# Altium schematic sheet Digital.SchDoc
size A2
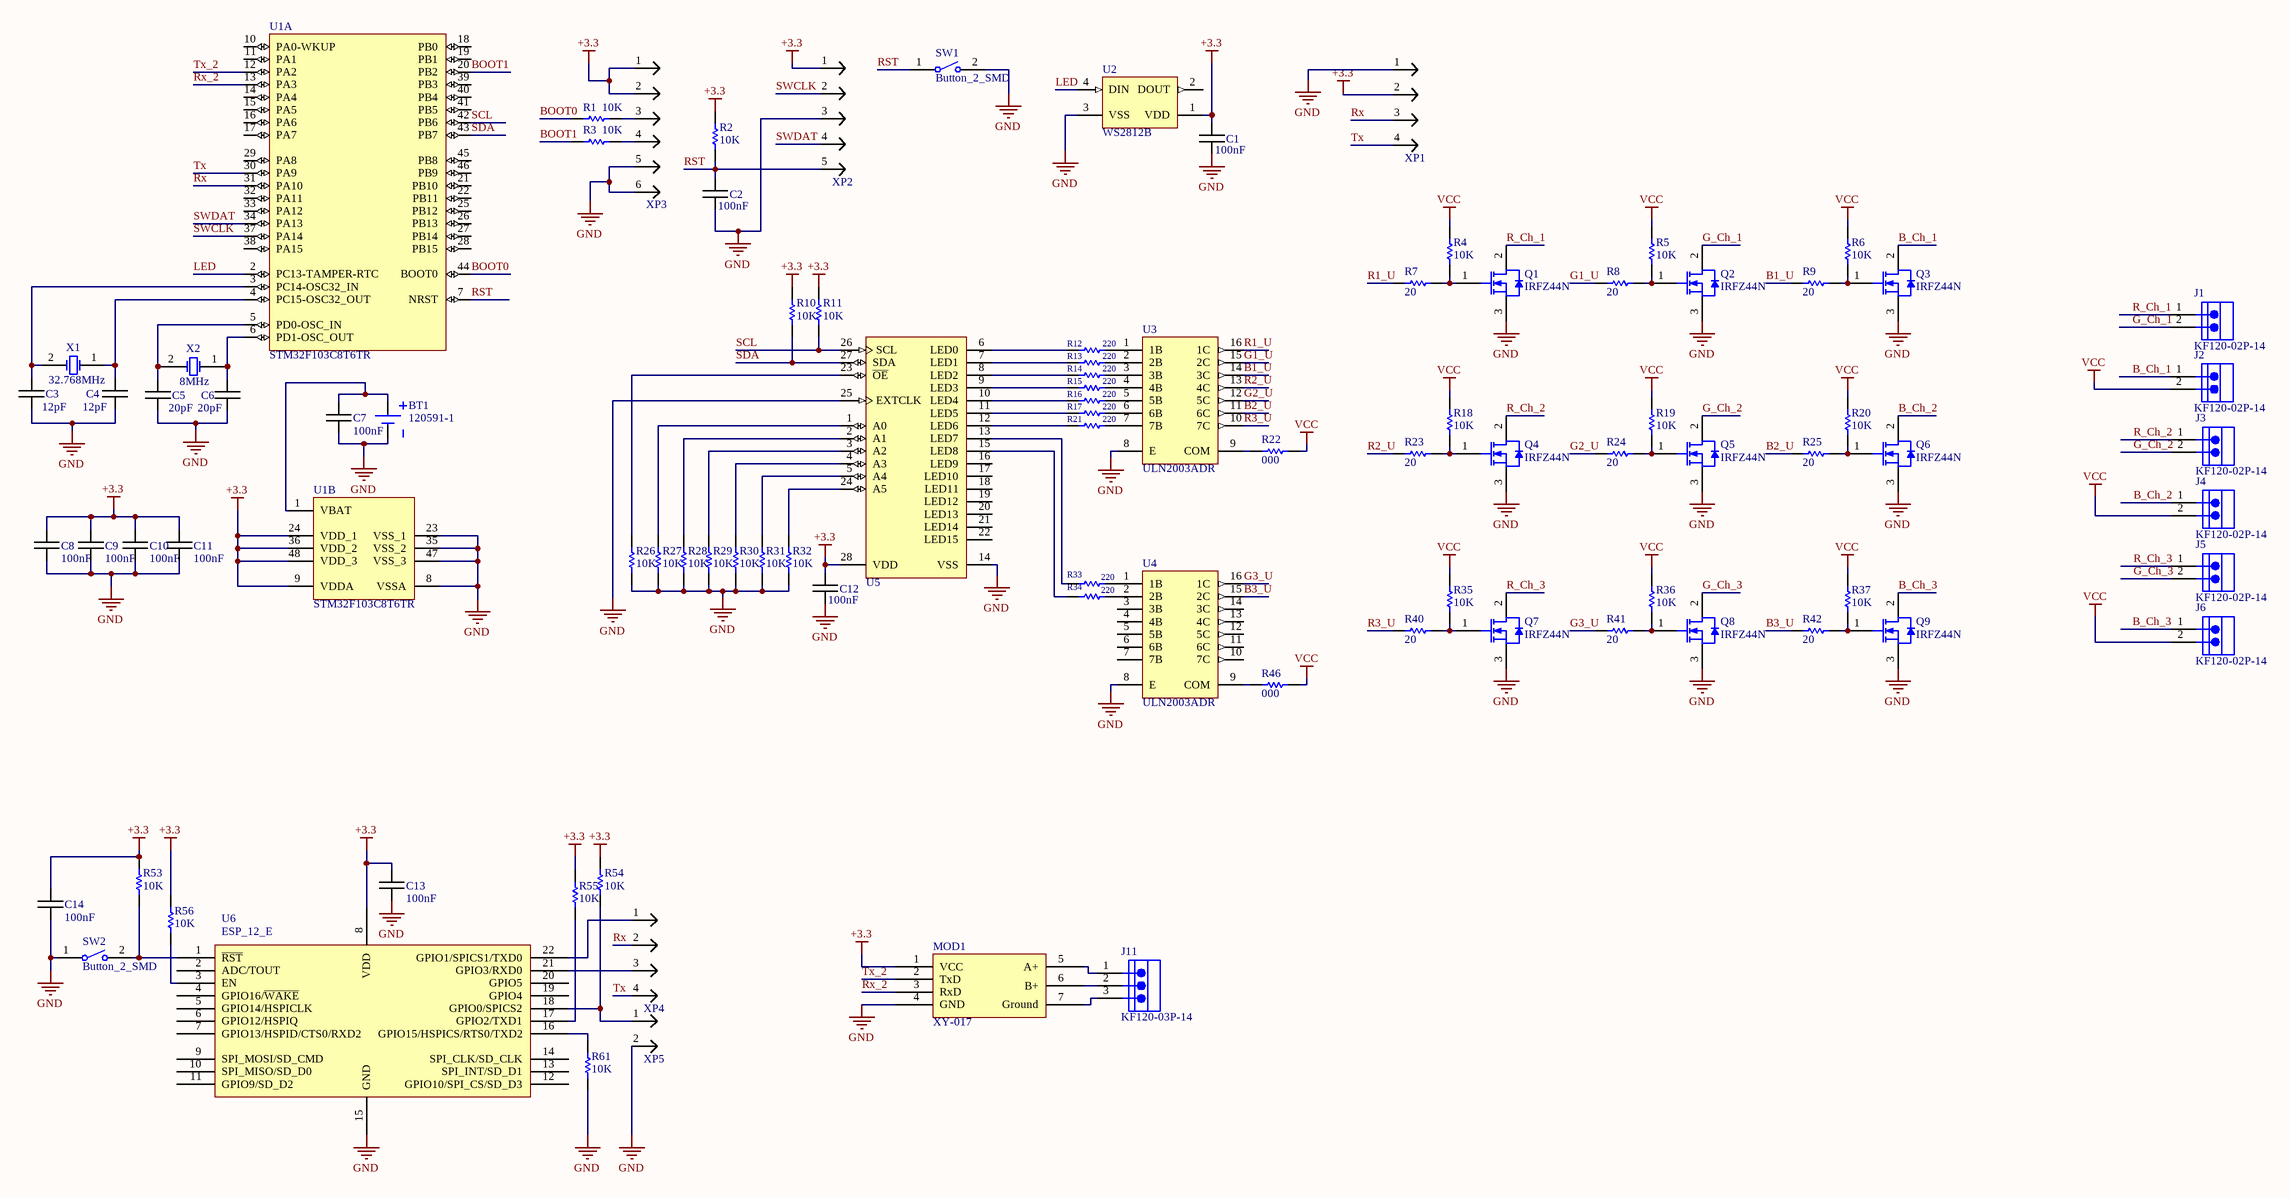
[diagram p0: Digital.SchDoc]

## Parts
BT1  120591-1  [TECO-120591-1-2_V]
C1  Val: 100nF  [CAP0805]  (hidden comment: CAP_SMD)
C2  Val: 100nF  [CAP0805]  (hidden comment: CAP_SMD)
C3  Val: 12pF  [CAP0805]  (hidden comment: CAP_SMD)
C4  Val: 12pF  [CAP0805]  (hidden comment: CAP_SMD)
C5  Val: 20pF  [CAP0805]  (hidden comment: CAP_SMD)
C6  Val: 20pF  [CAP0805]  (hidden comment: CAP_SMD)
C7  Val: 100nF  [CAP0805]  (hidden comment: CAP_SMD)
C8  Val: 100nF  [CAP0805]  (hidden comment: CAP_SMD)
C9  Val: 100nF  [CAP0805]  (hidden comment: CAP_SMD)
C10  Val: 100nF  [CAP0805]  (hidden comment: CAP_SMD)
C11  Val: 100nF  [CAP0805]  (hidden comment: CAP_SMD)
C12  Val: 100nF  [CAP0805]  (hidden comment: CAP_SMD)
C13  Val: 100nF  [CAP0805]  (hidden comment: CAP_SMD)
C14  Val: 100nF  [CAP0805]  (hidden comment: CAP_SMD)
J1  KF120-02P-14  [KF350-3.5-02P]
J2  KF120-02P-14  [KF350-3.5-02P]
J3  KF120-02P-14  [KF350-3.5-02P]
J4  KF120-02P-14  [KF350-3.5-02P]
J5  KF120-02P-14  [KF350-3.5-02P]
J6  KF120-02P-14  [KF350-3.5-02P]
J11  KF120-03P-14  [KF350-3.5-03P]
MOD1  XY-017  [XY-017]
Q1  IRFZ44N  [TO-220]
Q2  IRFZ44N  [TO-220]
Q3  IRFZ44N  [TO-220]
Q4  IRFZ44N  [TO-220]
Q5  IRFZ44N  [TO-220]
Q6  IRFZ44N  [TO-220]
Q7  IRFZ44N  [TO-220]
Q8  IRFZ44N  [TO-220]
Q9  IRFZ44N  [TO-220]
R1  Val: 10K  [RES0805]  (hidden comment: RES_SMD)
R2  Val: 10K  [RES0805]  (hidden comment: RES_SMD)
R3  Val: 10K  [RES0805]  (hidden comment: RES_SMD)
R4  Val: 10K  [RES0805]  (hidden comment: RES_SMD)
R5  Val: 10K  [RES0805]  (hidden comment: RES_SMD)
R6  Val: 10K  [RES0805]  (hidden comment: RES_SMD)
R7  Val: 20  [RES0805]  (hidden comment: RES_SMD)
R8  Val: 20  [RES0805]  (hidden comment: RES_SMD)
R9  Val: 20  [RES0805]  (hidden comment: RES_SMD)
R10  Val: 10K  [RES0805]  (hidden comment: RES_SMD)
R11  Val: 10K  [RES0805]  (hidden comment: RES_SMD)
R12  Val: 220  [RES0805]  (hidden comment: RES_SMD)
R13  Val: 220  [RES0805]  (hidden comment: RES_SMD)
R14  Val: 220  [RES0805]  (hidden comment: RES_SMD)
R15  Val: 220  [RES0805]  (hidden comment: RES_SMD)
R16  Val: 220  [RES0805]  (hidden comment: RES_SMD)
R17  Val: 220  [RES0805]  (hidden comment: RES_SMD)
R18  Val: 10K  [RES0805]  (hidden comment: RES_SMD)
R19  Val: 10K  [RES0805]  (hidden comment: RES_SMD)
R20  Val: 10K  [RES0805]  (hidden comment: RES_SMD)
R21  Val: 220  [RES0805]  (hidden comment: RES_SMD)
R22  Val: 000  [RES0805]  (hidden comment: RES_SMD)
R23  Val: 20  [RES0805]  (hidden comment: RES_SMD)
R24  Val: 20  [RES0805]  (hidden comment: RES_SMD)
R25  Val: 20  [RES0805]  (hidden comment: RES_SMD)
R26  Val: 10K  [RES0805]  (hidden comment: RES_SMD)
R27  Val: 10K  [RES0805]  (hidden comment: RES_SMD)
R28  Val: 10K  [RES0805]  (hidden comment: RES_SMD)
R29  Val: 10K  [RES0805]  (hidden comment: RES_SMD)
R30  Val: 10K  [RES0805]  (hidden comment: RES_SMD)
R31  Val: 10K  [RES0805]  (hidden comment: RES_SMD)
R32  Val: 10K  [RES0805]  (hidden comment: RES_SMD)
R33  Val: 220  [RES0805]  (hidden comment: RES_SMD)
R34  Val: 220  [RES0805]  (hidden comment: RES_SMD)
R35  Val: 10K  [RES0805]  (hidden comment: RES_SMD)
R36  Val: 10K  [RES0805]  (hidden comment: RES_SMD)
R37  Val: 10K  [RES0805]  (hidden comment: RES_SMD)
R40  Val: 20  [RES0805]  (hidden comment: RES_SMD)
R41  Val: 20  [RES0805]  (hidden comment: RES_SMD)
R42  Val: 20  [RES0805]  (hidden comment: RES_SMD)
R46  Val: 000  [RES0805]  (hidden comment: RES_SMD)
R53  Val: 10K  [RES0805]  (hidden comment: RES_SMD)
R54  Val: 10K  [RES0805]  (hidden comment: RES_SMD)
R55  Val: 10K  [RES0805]  (hidden comment: RES_SMD)
R56  Val: 10K  [RES0805]  (hidden comment: RES_SMD)
R61  Val: 10K  [RES0805]  (hidden comment: RES_SMD)
SW1  Button_2_SMD  [SMD_BUT_6.3mm]
SW2  Button_2_SMD  [SMD_BUT_6.3mm]
U1  STM32F103C8T6TR  [STM-LQFP48_L]  (parts A,B of 2)
U2  WS2812B  [WS2812B]
U3  ULN2003ADR  [SO-16_L]
U4  ULN2003ADR  [SO-16_L]
U5  PCA9685PW,112  [SOT361-1_V]  (value not drawn)
U6  ESP_12_E  [ESP_12_E]
X1  32.768MHz  [Crystal_DIP - 3x8]
X2  8MHz  [Crystal_SMD]
XP1  PLS-04  [PLS-04]  (value not drawn)
XP2  PLS-05  [PLS-05]  (value not drawn)
XP3  PLS-03_2  [PLS-03_2]  (value not drawn)
XP4  PLS-02_2  [PLS-02_2]  (value not drawn)
XP5  PLS-02  [PLS-02]  (value not drawn)

## Nets
+3.3: C1.2 C8.2 C9.2 C10.2 C11.2 C12.2 C13.2 C14.2 MOD1.1(VCC) R2.2 R10.2 R11.2 R53.2 R54.2 R55.2 R56.2 U1.9(VDDA) U1.24(VDD_1) U1.36(VDD_2) U1.48(VDD_3) U2.1(VDD) U5.28(VDD) U6.8(VDD) XP1.2 XP2.1 XP3.1 XP3.2
GND: BT1.2(-) C1.1 C2.1 C3.1 C4.1 C5.1 C6.1 C7.1 C8.1 C9.1 C10.1 C11.1 C12.1 C13.1 C14.1 MOD1.4(GND) Q1.3(S) Q2.3(S) Q3.3(S) Q4.3(S) Q5.3(S) Q6.3(S) Q7.3(S) Q8.3(S) Q9.3(S) R26.1 R27.1 R28.1 R29.1 R30.1 R31.1 R32.1 R61.1 SW1.2 SW2.1 U1.8(VSSA) U1.23(VSS_1) U1.35(VSS_2) U1.47(VSS_3) U2.3(VSS) U3.8(E) U4.8(E) U5.14(VSS) U5.25(EXTCLK) U6.15(GND) XP1.1 XP2.3 XP3.5 XP3.6 XP5.2
VCC: J2.2 J4.2 J6.2 R4.2 R5.2 R6.2 R18.2 R19.2 R20.2 R22.2 R35.2 R36.2 R37.2 R46.2
B1_U: R9.1 U3.14(3C)
B2_U: R25.1 U3.11(6C)
B3_U: R42.1 U4.15(2C)
B_Ch_1: J2.1 Q3.2(D)
B_Ch_2: J4.1 Q6.2(D)
B_Ch_3: J6.1 Q9.2(D)
BOOT0: R1.1 U1.44(BOOT0)
BOOT1: R3.1 U1.20(PB2)
G1_U: R8.1 U3.15(2C)
G2_U: R24.1 U3.12(5C)
G3_U: R41.1 U4.16(1C)
G_Ch_1: J1.2 Q2.2(D)
G_Ch_2: J3.2 Q5.2(D)
G_Ch_3: J5.2 Q8.2(D)
LED: U1.2(PC13-TAMPER-RTC) U2.4(DIN)
R1_U: R7.1 U3.16(1C)
R2_U: R23.1 U3.13(4C)
R3_U: R40.1 U3.10(7C)
R_Ch_1: J1.1 Q1.2(D)
R_Ch_2: J3.1 Q4.2(D)
R_Ch_3: J5.1 Q7.2(D)
RST: C2.2 R2.1 SW1.1 U1.7(NRST) XP2.5
Rx: U1.31(PA10) XP1.3 XP4.2
Rx_2: MOD1.3(RxD) U1.13(PA3)
SCL: R11.1 U1.42(PB6) U5.26(SCL)
SDA: R10.1 U1.43(PB7) U5.27(SDA)
SWCLK: U1.37(PA14) XP2.2
SWDAT: U1.34(PA13) XP2.4
Tx: U1.30(PA9) XP1.4 XP4.4
Tx_2: MOD1.2(TxD) U1.12(PA2)
NetBT1_1: BT1.1(+) C7.2 U1.1(VBAT)
NetC3_2: C3.2 U1.3(PC14-OSC32_IN) X1.2(X2)
NetC4_2: C4.2 U1.4(PC15-OSC32_OUT) X1.1(X1)
NetC5_2: C5.2 U1.5(PD0-OSC_IN) X2.2(X2)
NetC6_2: C6.2 U1.6(PD1-OSC_OUT) X2.1(X1)
NetJ11_1: J11.1 MOD1.5(A+)
NetJ11_2: J11.2 MOD1.6(B+)
NetJ11_3: J11.3 MOD1.7(Ground)
NetQ1_1: Q1.1(G) R4.1 R7.2
NetQ2_1: Q2.1(G) R5.1 R8.2
NetQ3_1: Q3.1(G) R6.1 R9.2
NetQ4_1: Q4.1(G) R18.1 R23.2
NetQ5_1: Q5.1(G) R19.1 R24.2
NetQ6_1: Q6.1(G) R20.1 R25.2
NetQ7_1: Q7.1(G) R35.1 R40.2
NetQ8_1: Q8.1(G) R36.1 R41.2
NetQ9_1: Q9.1(G) R37.1 R42.2
NetR1_2: R1.2 XP3.3
NetR3_2: R3.2 XP3.4
NetR12_1: R12.1 U3.1(1B)
NetR12_2: R12.2 U5.6(LED0)
NetR13_1: R13.1 U3.2(2B)
NetR13_2: R13.2 U5.7(LED1)
NetR14_1: R14.1 U3.3(3B)
NetR14_2: R14.2 U5.8(LED2)
NetR15_1: R15.1 U3.4(4B)
NetR15_2: R15.2 U5.9(LED3)
NetR16_1: R16.1 U3.5(5B)
NetR16_2: R16.2 U5.10(LED4)
NetR17_1: R17.1 U3.6(6B)
NetR17_2: R17.2 U5.11(LED5)
NetR21_1: R21.1 U3.7(7B)
NetR21_2: R21.2 U5.12(LED6)
NetR22_1: R22.1 U3.9(COM)
NetR26_2: R26.2 U5.23(~{OE})
NetR27_2: R27.2 U5.1(A0)
NetR28_2: R28.2 U5.2(A1)
NetR29_2: R29.2 U5.3(A2)
NetR30_2: R30.2 U5.4(A3)
NetR31_2: R31.2 U5.5(A4)
NetR32_2: R32.2 U5.24(A5)
NetR33_1: R33.1 U4.1(1B)
NetR33_2: R33.2 U5.13(LED7)
NetR34_1: R34.1 U4.2(2B)
NetR34_2: R34.2 U5.15(LED8)
NetR46_1: R46.1 U4.9(COM)
NetR53_1: R53.1 SW2.2 U6.1(~{RST})
NetR54_1: R54.1 U6.18(GPIO0/SPICS2) XP5.1
NetR55_1: R55.1 U6.17(GPIO2/TXD1)
NetR56_1: R56.1 U6.3(EN)
NetR61_2: R61.2 U6.16(GPIO15/HSPICS/RTS0/TXD2)
NetU6_21: U6.21(GPIO3/RXD0) XP4.3
NetU6_22: U6.22(GPIO1/SPICS1/TXD0) XP4.1

Not connected (* = marked no-connect by the designer): U1 10(PA0-WKUP) 11(PA1) 14(PA4) 15(PA5) 16(PA6) 17(PA7) 18(PB0) 19(PB1) 21(PB10) 22(PB11) 25(PB12) 26(PB13) 27(PB14) 28(PB15) 29(PA8) 32(PA11) 33(PA12) 38(PA15) 39(PB3) 40(PB4) 41(PB5) 45(PB8) 46(PB9); U2 2(DOUT); U4 3(3B) 4(4B) 5(5B) 6(6B) 7(7B) 10(7C) 11(6C) 12(5C) 13(4C) 14(3C); U5 16(LED9) 17(LED10) 18(LED11) 19(LED12) 20(LED13) 21(LED14) 22(LED15); U6 2(ADC/TOUT) 4(GPIO16/~{WAKE}) 5(GPIO14/HSPICLK) 6(GPIO12/HSPIQ) 7(GPIO13/HSPID/CTS0/RXD2) 9(SPI_MOSI/SD_CMD) 10(SPI_MISO/SD_D0) 11(GPIO9/SD_D2) 12(GPIO10/SPI_CS/SD_D3) 13(SPI_INT/SD_D1) 14(SPI_CLK/SD_CLK) 19(GPIO4) 20(GPIO5)

## Library data of the parts
BT1 = CR-2032: Lithium Battery Holder for CR2032 3V Cell; Manufacturer: TE Connectivity; Body Shape: Horizontal Cylindrical; Packing Type: Tray; ComponentLink2Description: Datasheet; ComponentLink2URL: http://www.te.com/commerce/DocumentDelivery/DDEController?Action=showdoc&DocId=Customer+Drawing%7F120591%7FH%7Fpdf%7FEnglish%7FENG_CD_120591_H.pdf%7F120591-1; DatasheetVersion: Rev. H, 01/2013; PackageReference: 120591-1; ComponentLink1Description: Manufacturer URL; Mounting Technology: Through Hole; PackageDescription: Lithium Battery Holder; ComponentLink1URL: http://www.te.com/; PartNumber: 120591-1
C1-C14 = CAP_SMD: Ceramic capacitor, 0805
J1-J6 = Terminal_2: Euro Terminal Block, 6 A, 150 V, -40 to 105 degC, Pitch 2.54 mm, 1x2 Position, Height 8.6 mm, Tail Length 3.3 mm; Manufacturer: Cixi KaiFeng; Rated Current: 6 A; Contact: Brass; Insulation Resistance: 5000 MOhm / 1000 V; Rated Voltage: 150 V; No. of Pole: 2; Withstanding Voltage: AC 1500 V / 1 Min; Contact Resistance: 20 mOhm; Pitch: Single Pitch; PackageReference: KF120-2; Color: Green; Mounting Technology: Through Hole; PartNumber: KF120-02P-14; PackageDescription: Terminal Block, Pitch 2.54 mm, 1 x 2 Position, Height 8.6 mm, Tail Length 3.3 mm; ComponentLink2Description: Datasheet; ComponentLink1Description: Manufacturer URL; ComponentLink2URL: http://www.nb-kaifeng.com/upload/editor/ext_pdf/201305290533202245.pdf; Temp. Range: -40 to 105 degC; ComponentLink1URL: http://www.nb-kaifeng.com/
J11 = Terminal_3: Euro Terminal Block, 6 A, 150 V, -40 to 105 degC, Pitch 2.54 mm, 1x3 Position, Height 8.6 mm, Tail Length 3.3 mm; Manufacturer: Cixi KaiFeng; Insulation Resistance: 5000 mOhm / 1000 V; Pitch: Single Pitch; Rated Current: 6 A; Contact: Brass; Contact Resistance: 20 mOhm; No. of Pole: 3; Rated Voltage: 150 V; Withstanding Voltage: AC 1500 V / 1 Min; DatasheetVersion: Dec-13; ComponentLink3URL: http://www.nb-kaifeng.com/upload/editor/ext_pdf/201305290533202245.pdf; ComponentLink1Description: Manufacturer URL; ComponentLink2URL: http://www.nb-kaifeng.com/upload/editor/ext_pdf/201305290533107785.pdf; ComponentLink3Description: Package Specification; Color: Green; ComponentLink1URL: http://www.nb-kaifeng.com/; ComponentLink2Description: Datasheet; PackageVersion: Dec-13; Temp. Range: -40 to 105 degC; Mounting Technology: Through Hole; PackageDescription: Terminal Block, Pitch 2.54 mm, 1 x 3 Position, Height 8.6 mm, Tail Length 3.3 mm; PartNumber: KF120-03P-14; PackageReference: CXKF-KF120-3
MOD1 = XY-017: XY-017 RS-485 to ttl module
Q1-Q9 = IRFZ44N: N-channel Enhancement Mode Power MOSFET 49A/55V
SW1 SW2 = Button_2_SMD: Manufacturer: TE Connectivity; Actuator Length: 1.07mm; Electrical Life: 20000Cycles; Actuator Material: Polyamide; Current Rating: 50mA; Illumination Type: Illuminated; Voltage Rating (DC): 24V; Contact Resistance: 100mOhm; Case\/Package: SMD/SMT; Operating Force: 180gf; Switch Travel: 0.25mm; Max Voltage Rating (DC): 12V; Throw Configuration: SPST; Packaging: LoosePiece; Max Operating Temperature: 85degC; ELV: Compliant; Package Description: 2-Pin Surface Mount Device, Body 6 x 3.5 mm, Pitch 9.19 mm; RoHSCompliant: true; Manufacturer URL: http://www.te.com/; Contact Plating: Silver; Contact Material: Brass; Mounting Technology: SurfaceMount; Contact Current Rating: 50mA; Datasheet Version: Rev. C2, 08/2014; Datasheet URL: http://www.te.com/commerce/DocumentDelivery/DDEController?Action=showdoc&DocId=Customer+Drawing%7F1437566-3%7FC2%7Fpdf%7FEnglish%7FENG_CD_1437566-3_C2_1437566_3_1_c.dwg.pdf%7F1437566-3; Mechanical Life: 20000Cycles; Package Reference: FSMSM; REACH SVHC: Unknown; Orientation: Straight; Min Operating Temperature: -35degC; Lead Free: LeadFree; Termination: GullWing; Package Quantity: 1000; Mount: SurfaceMount
U1 = STM32F103C8T6: ARM Cortex-M3 32-bit MCU, 64 KB Flash, 20 KB Internal RAM, 37 I/Os, 48-pin LQFP, -40 to 85 degC, Tape and Reel; A/D Converter: 2x12-bit (10 Channel); Internal RAM Size (kB): 20; Supply Voltage(Vcc) min (V): 2; I/Os (High Current): 37; FLASH Size (Prog) (kB): 64; Operating Frequency(F) (Processor speed) (MHz): 72; Packing: Tape and Reel; PackageReference: LQFP48; ComponentLink2Description: Datasheet; Core: ARM Cortex-M3; ComponentLink3URL: http://www.st.com/st-web-ui/static/active/en/resource/technical/document/datasheet/DM00058181.pdf; ComponentLink1Description: Manufacturer URL; ComponentLink3Description: Package Specification; PartNumber: STM32F103C8T6TR; PackageVersion: Rev. 6, 06/2013; ComponentLink2URL: http://www.st.com/st-web-ui/static/active/en/resource/technical/document/datasheet/CD00161566.pdf; PackageDescription: 48-Pin Low Profile Quad Flat Package, 7 x 7 mm Body, 0.5 mm Pitch; Mounting Technology: Surface Mount; DatasheetVersion: Rev. 16; ComponentLink1URL: http://www.st.com/web/en/home.html
U2 = WS2812B: Intelligent Control LED Integrated Light Source, 3.5 to 5.3 V, -25 to 80 degC, 4-Pin SMD, RoHS, Bulk; Case\Package: Radial; Shielding: Unshielded; Current Rating: 240 mA; Tolerance: 10%; Mount: Through Hole; Max Operating Temperature: 125 degC; Radiation Hardening: No; Length: 12.2 mm; Min Operating Temperature: -55 degC; ComponentLink1URL: https://www.adafruit.com/; Packaging: Bulk; Lead Pitch: 5 mm; RoHSCompliant: true; Pins: 2; Package Quantity: 200; ComponentLink2URL: https://cdn-shop.adafruit.com/datasheets/WS2812B.pdf; ComponentLink2Description: Datasheet; PackageDescription: 4-Pin Surface Mount Device, Body 5 x 5 mm, Pitch 3.3 mm; PackageReference: WS2812B; Height: 12.2 mm; REACH SVHC: No SVHC; ComponentLink1Description: Manufacturer URL; DatasheetVersion: May-13
U3 U4 = ULN2003A: High-Voltage, High-Current Darlington Transistor Array, 0.5 A, 50 V, -20 to 70 degC, 16-Pin SOIC (D), Green (RoHS & no Sb/Br), Tape and Reel; Manufacturer: TexasInstruments; Peak DC Collector Current: 0.5A; Package Version: 4040047-6/M, 06/2011; Maximum Collector Emitter Voltage: 50V; Configuration: Array7; Maximum Collector Emitter Saturation Voltage: 1.1@100mA|1.3@200mA|1.6@350mAV; Rad Hard: No; Packaging: Tape&Reel; Datasheet URL: http://www.ti.com/general/docs/lit/getliterature.tsp?genericPartNumber=uln2003a&fileType=pdf; Package Reference: D16; Category: DarlingtonBJT; Datasheet Version: Rev. O, 01/2016; Manufacturer URL: http://www.ti.com/; Type: NPN; Package Description: 16-Pin Plastic Small Outline, Body 9.9 x 3.9 mm, Pitch 1.27 mm; Mounting: SurfaceMount; Package: 16SOIC; Package URL: http://www.ti.com/lit/ml/mpds178g/mpds178g.pdf
U5 = PCA9685: 16-Channel, 12-Bit PWM Fm+ I2C-Bus LED Controller, 2.3 to 5.5 V, -40 to 85 degC, 28-Pin TSSOP (SOT361-1), RoHS, Tape and Reel; ComponentLink1Description: Manufacturer URL; ComponentLink2URL: http://www.nxp.com/documents/data_sheet/PCA9685.pdf; ComponentLink1URL: http://www.nxp.com/; ComponentLink3Description: Package Specification; ComponentLink2Description: Datasheet; ComponentLink3URL: http://www.nxp.com/documents/outline_drawing/sot361-1_po.pdf
U6 = ESP_12_E: ESP-12 Wi-Fi Module by AI-Thinker; IC: ESP8266-EX; Vendor: Ai-thinker
X1 = Crystal: Low Profile Crystal; Brand: ABRACON; Case Length: 11.4mm; Frequency Stability: 50PPM; ESR: 80Ohms; Case Height: 4.2mm; Tolerance: 30PPM; Frequency: 8MHz; Case Width: 4.7mm; Load Capacitance: 18pF; Datasheet Version: 04/2011; Termination Style: SMD/SMT; Dimensions: 4.7mmWx11.4mmLx4.2mmH; Packaging: Reel; Manufacturer: ABRACON; Package URL: http://www.abracon.com/Support/PackageDrawing/Resonators/ABLS-2D.pdf; Mounting Technology: SurfaceMount; Package Reference: ABLS-14.7456MHZ-B2-T; Product Category: Crystals; Package Description: 2-Pin Surface Mount Device, Body 11.4 x 4.7 mm; Package / Case: HC-49/US; Mounting Style: SMD/SMT; Operating Temperature Range: -20Cto+70C; Series: ABLS; Factory Pack Quantity: 1000; Datasheet URL: http://www.abracon.com/Resonators/abls.pdf; Manufacturer URL: http://www.abracon.com/; RoHS: Details; Type: LowProfileMicroprocessorCrystal
X2 = Crystal: Low Profile Crystal; Brand: ABRACON; Case Length: 11.4mm; Frequency Stability: 50PPM; ESR: 80Ohms; Case Height: 4.2mm; Tolerance: 30PPM; Case Width: 4.7mm; Load Capacitance: 18pF; Datasheet Version: 04/2011; Termination Style: SMD/SMT; Dimensions: 4.7mmWx11.4mmLx4.2mmH; Packaging: Reel; Manufacturer: ABRACON; Package URL: http://www.abracon.com/Support/PackageDrawing/Resonators/ABLS-2D.pdf; Mounting Technology: SurfaceMount; Package Reference: ABLS-14.7456MHZ-B2-T; Product Category: Crystals; Package Description: 2-Pin Surface Mount Device, Body 11.4 x 4.7 mm; Package / Case: HC-49/US; Mounting Style: SMD/SMT; Operating Temperature Range: -20Cto+70C; Series: ABLS; Frequency: 8MHz; Factory Pack Quantity: 1000; Datasheet URL: http://www.abracon.com/Resonators/abls.pdf; Manufacturer URL: http://www.abracon.com/; RoHS: Details; Type: LowProfileMicroprocessorCrystal